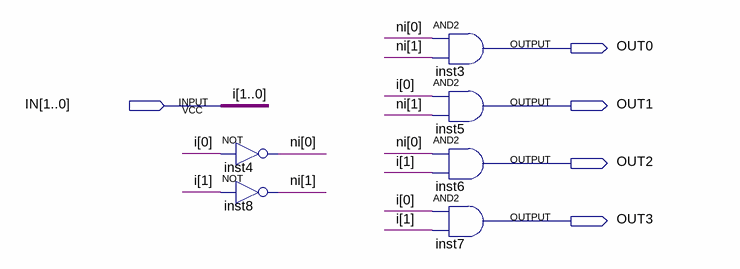
[diagram p0: schematic sheet]
// Quartus schematic encoder2to4.bdf as structural Verilog: 6 symbols, 5 pins
module encoder2to4 (
  input  [1:0] IN,
  output OUT0,
  output OUT1,
  output OUT2,
  output OUT3
);

  wire [1:0] ni;

  not inst4 (ni[0], IN[0]);
  not inst8 (ni[1], IN[1]);
  and inst3 (OUT0, ni[0], ni[1]);
  and inst5 (OUT1, IN[0], ni[1]);
  and inst6 (OUT2, ni[0], IN[1]);
  and inst7 (OUT3, IN[0], IN[1]);

  // Other names for the same wires on the sheet: i[1:0] = IN
endmodule
